# EAGLE schematic Shutter Controller ATMega168 Connection (EAGLE 7.2.0)
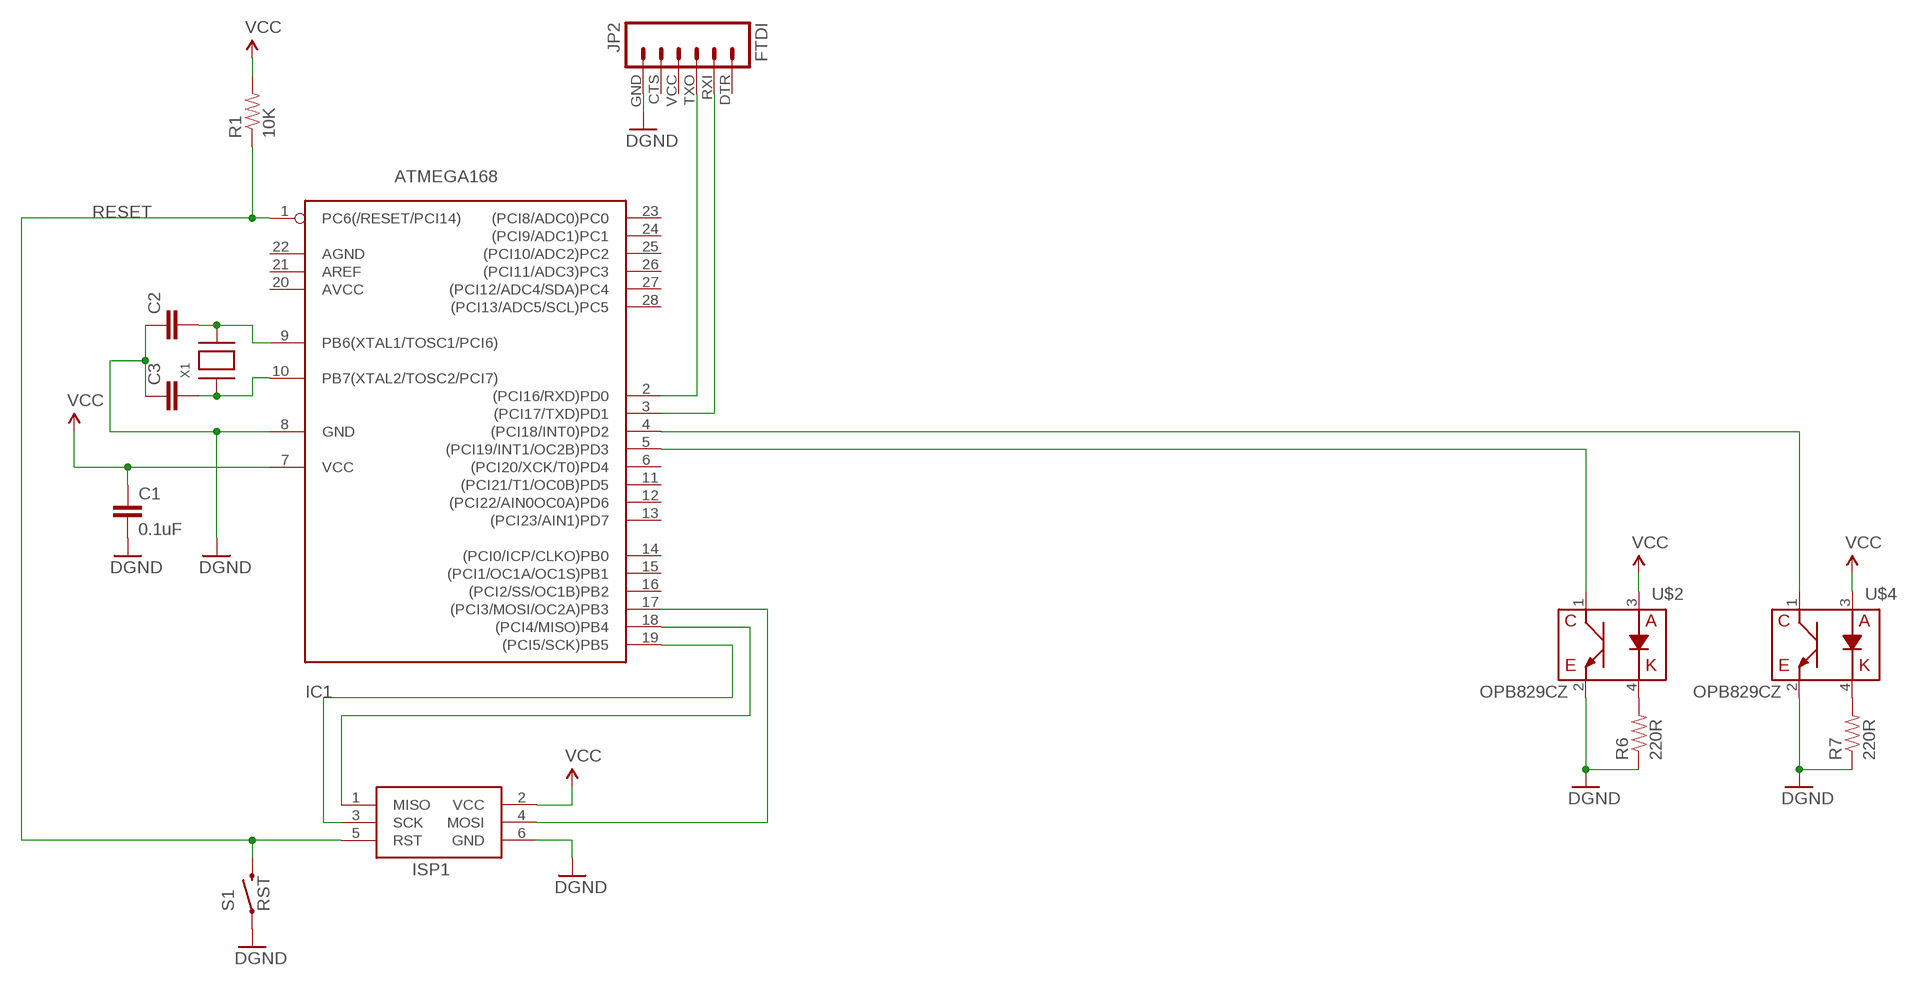
[diagram p0: schematic, sheet 1]

## Parts
C1  0.1uF  CAPPTH  [CAP-PTH-SMALL]
C2  CAPPTH  [CAP-PTH-SMALL]
C3  CAPPTH  [CAP-PTH-SMALL]
IC1  ATMEGA168  ATMEGA168PROUND  [DIL28-3-ROUND]
ISP1  AVRISP-6  [AVRISP]
JP2  FTDI  FTDI_BASICPTH  [FTDI_BASIC]
R1  10K  RESISTORPTH-1/6W  [1/6W-RES]
R6  220R  RESISTORPTH-1/6W  [1/6W-RES]
R7  220R  RESISTORPTH-1/6W  [1/6W-RES]
S1  RST  SWITCH-MOMENTARY-2  [TACTILE_SWITCH_TALL]
U$2  OPB829CZ  QRD1114  [QRD1114]
U$4  OPB829CZ  QRD1114  [QRD1114]
X1  XTALNX8045  [NX8045]

## Nets
GND: C1.2 C2.1 C3.1 IC1.8(GND) ISP1.6(GND) JP2.GND R6.1 R7.1 S1.A2 U$2.2(C) U$4.2(C) ; supply symbol labelled DGND
N$1: IC1.19((PCI5/SCK)PB5) ISP1.3(SCK)
N$2: IC1.18((PCI4/MISO)PB4) ISP1.1(MISO)
N$3: IC1.17((PCI3/MOSI/OC2A)PB3) ISP1.4(MOSI)
N$4: IC1.5((PCI19/INT1/OC2B)PD3) U$2.1(E)
N$5: C2.2 X1.P$2
N$6: IC1.4((PCI18/INT0)PD2) U$4.1(E)
N$8: IC1.3((PCI17/TXD)PD1) JP2.RXI
N$10: C3.2 X1.P$1
N$11: R6.2 U$2.4(K)
N$14: R7.2 U$4.4(K)
N$15: IC1.2((PCI16/RXD)PD0) JP2.TXO
RESET: IC1.1(PC6(/RESET/PCI14)) ISP1.5(RST) R1.1 S1.B2
VCC: C1.1 IC1.7(VCC) ISP1.2(VCC) R1.2 U$2.3(A) U$4.3(A)
Unconnected: IC1.6((PCI20/XCK/T0)PD4) IC1.9(PB6(XTAL1/TOSC1/PCI6)) IC1.10(PB7(XTAL2/TOSC2/PCI7)) IC1.11((PCI21/T1/OC0B)PD5) IC1.12((PCI22/AIN0OC0A)PD6) IC1.13((PCI23/AIN1)PD7) IC1.14((PCI0/ICP/CLKO)PB0) IC1.15((PCI1/OC1A/OC1S)PB1) IC1.16((PCI2/SS/OC1B)PB2) IC1.20(AVCC) IC1.21(AREF) IC1.22(AGND) IC1.23((PCI8/ADC0)PC0) IC1.24((PCI9/ADC1)PC1) IC1.25((PCI10/ADC2)PC2) IC1.26((PCI11/ADC3)PC3) IC1.27((PCI12/ADC4/SDA)PC4) IC1.28((PCI13/ADC5/SCL)PC5) JP2.CTS JP2.DTR JP2.VCC

## Library data of the parts
C1-C3 = SparkFun-Passives:CAP: Capacitor Standard 0603 ceramic capacitor, and 0.1" leaded capacitor.
IC1 = adafruit:ATMEGA168*P: MICROCONTROLLER 16 kBytes FLASH 1 kBytes SRAM 512 Bytes EEPROM USART 8-channel 10 bit ADC
ISP1 = adafruit:AVRISP: AVR ISP HEADER Standard 6 pin header for AVR programming
JP2 = SparkFun-Connectors:FTDI_BASIC: FTDI Basic header with labels
R1 R6 R7 = SparkFun-Passives:RESISTOR: Resistor Basic schematic elements and footprints for 0603, 1206, and PTH resistors.
S1 = SparkFun-Electromechanical:SWITCH-MOMENTARY-2: Various NO switches- pushbuttons, reed, etc
U$2 U$4 = SparkFun-Sensors:QRD1114: Reflective object sensor
X1 = adafruit:XTAL: Low cost SMT crystals, no capacitors included http://www.ladyada.net/library/eagle